# EAGLE design CR78-HB (EAGLE 7.1.0)
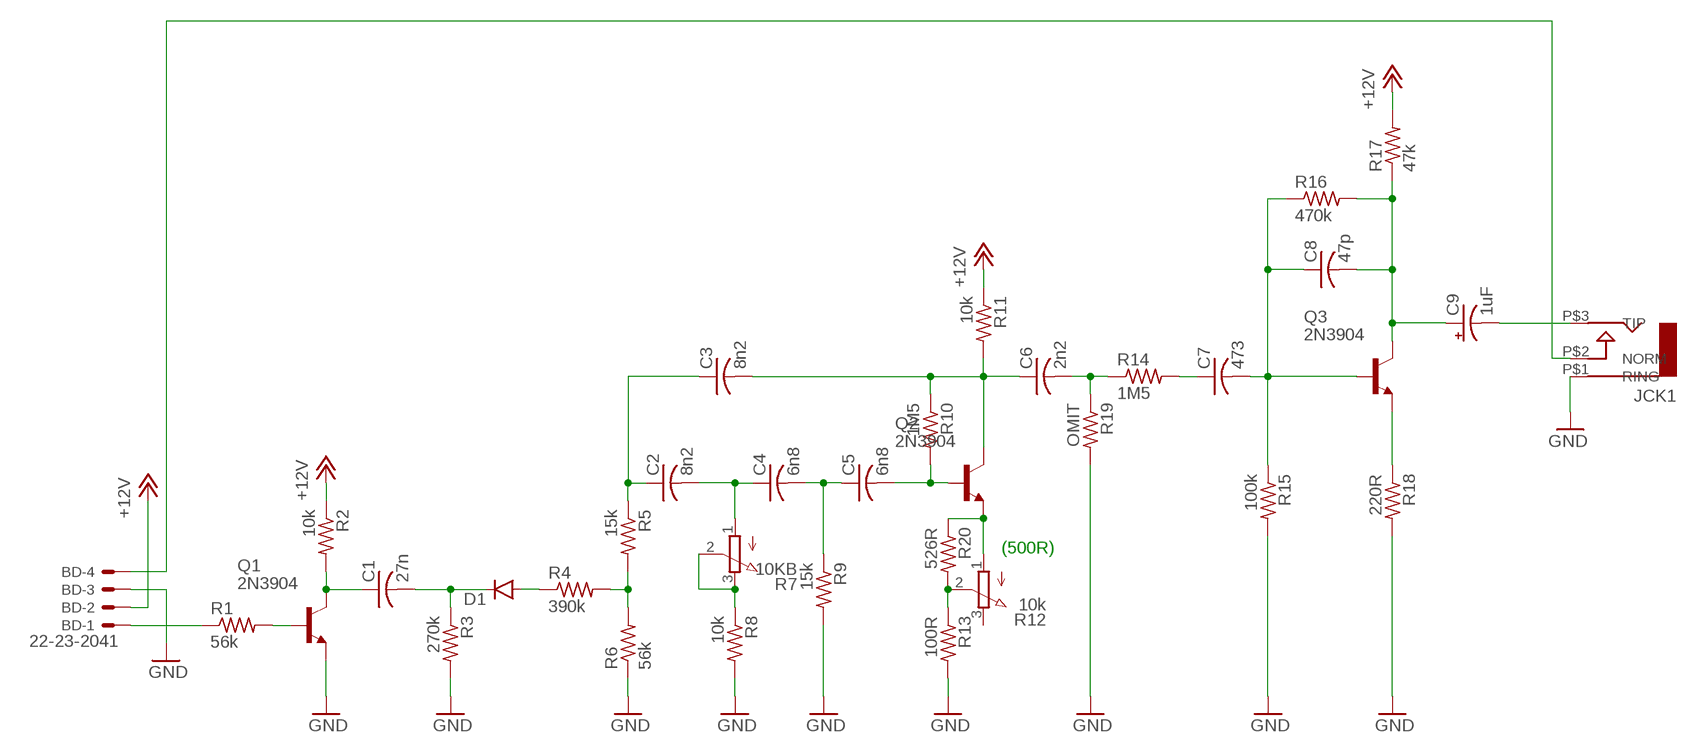
[diagram p0: schematic, sheet 1]

## Parts
BD  22-23-2041  [22-23-2041]
C1  27n  C-US050-025X075  [C050-025X075]
C2  8n2  C-US050-025X075  [C050-025X075]
C3  8n2  C-US050-025X075  [C050-025X075]
C4  6n8  C-US050-025X075  [C050-025X075]
C5  6n8  C-US050-025X075  [C050-025X075]
C6  2n2  C-US050-025X075  [C050-025X075]
C7  473  C-US050-025X075  [C050-025X075]
C8  47p  C-US050-025X075  [C050-025X075]
C9  1uF  CPOL-USB45181A  [B45181A]
D1  DIODE1N4148  [DIODE-1N4148]
JCK1  AUDIO-JACK  [ERTHENVAR-JACK-90DEG]
Q1  2N3904  [TO92]
Q2  2N3904  [TO92]
Q3  2N3904  [TO92]
R1  56k  R-US_0207/7  [0207/7]
R2  10k  R-US_0207/7  [0207/7]
R3  270k  R-US_0207/7  [0207/7]
R4  390k  R-US_0207/7  [0207/7]
R5  15k  R-US_0207/7  [0207/7]
R6  56k  R-US_0207/7  [0207/7]
R7  10KB  3RP/1610N  [3RP/1610N]
R8  10k  R-US_0207/7  [0207/7]
R9  15k  R-US_0207/5V  [0207/5V]
R10  1M5  R-US_0207/7  [0207/7]
R11  10k  R-US_0207/7  [0207/7]
R12  10k  3RP/1610N  [3RP/1610N]
R13  100R  R-US_0207/7  [0207/7]
R14  1M5  R-US_0207/7  [0207/7]
R15  100k  R-US_0207/7  [0207/7]
R16  470k  R-US_0207/7  [0207/7]
R17  47k  R-US_0207/7  [0207/7]
R18  220R  R-US_0207/7  [0207/7]
R19  OMIT  R-US_0207/5V  [0207/5V]
R20  526R  R-US_0207/5V  [0207/5V]

## Nets
+12V: BD.2 R2.1 R11.1 R17.2
GND: BD.3 JCK1.P$1(RING) Q1.3(E) R3.2 R6.1 R8.2 R9.2 R13.2 R15.2 R18.2 R19.2
N$1: C1.2 D1.C R3.1
N$2: D1.A R4.1
N$3: R4.2 R5.2 R6.2
N$4: C2.1 C3.1 R5.1
N$5: R7.2(S) R7.3(E) R8.1
N$6: C2.2 C4.1 R7.1(A)
N$7: C5.2 Q2.2(B) R10.2
N$8: R12.2(S) R13.1 R20.2
N$9: C3.2 C6.1 Q2.1(C) R10.1 R11.2
N$10: C4.2 C5.1 R9.1
N$11: BD.1 R1.1
N$12: BD.4 JCK1.P$2(NORM)
N$13: Q2.3(E) R12.1(A) R20.1
N$14: C6.2 R14.1 R19.1
N$15: Q3.3(E) R18.1
N$16: C8.2 C9.+ Q3.1(C) R16.2 R17.1
N$17: C7.1 R14.2
N$18: C7.2 C8.1 Q3.2(B) R15.1 R16.1
N$19: C9.- JCK1.P$3(TIP)
N$46: C1.1 Q1.1(C) R2.2
N$47: Q1.2(B) R1.2
Unconnected: R12.3(E)

## Notes on the sheet
- (500R)

## Library data of the parts
BD = con-molex:22-23-2041: .100" (2.54mm) Center Header - 4 Pin; MF: MOLEX; MPN: 22-23-2041; OC_FARNELL: 1462920; OC_NEWARK: 38C0355
C1-C8 = rcl:C-US: CAPACITOR, American symbol
C9 = rcl:CPOL-US: POLARIZED CAPACITOR, American symbol
D1 = SparkFun-DiscreteSemi:DIODE: Diode These are standard reverse protection diodes and small signal diodes. SMA package can handle up to about 1A. SOD-323 can handle about 200mA. What the SOD-323 package when ordering, there are some mfgs out there that are 5-pin packages.
JCK1 = erthenvar:AUDIO-JACK: Switching Mono 3.5mm Audio Jack from Erthenvar.
Q1-Q3 = 808_lt:2N3904: NPN Transistor
R1-R6 R8-R11 R13-R20 = rcl:R-US_: RESISTOR, American symbol
R7 R12 = pot:3RP/1610N: 16mm Potentiometer one level Source: http://www.alphapotentiometers.net/html/16mm_pot_2.html

## Net classes
0 default: width 0.635 mm, drill 0.254 mm, clearance 0.254 mm
1 GND: width 1.016 mm, drill 1.016 mm, clearance 0.508 mm

## Board
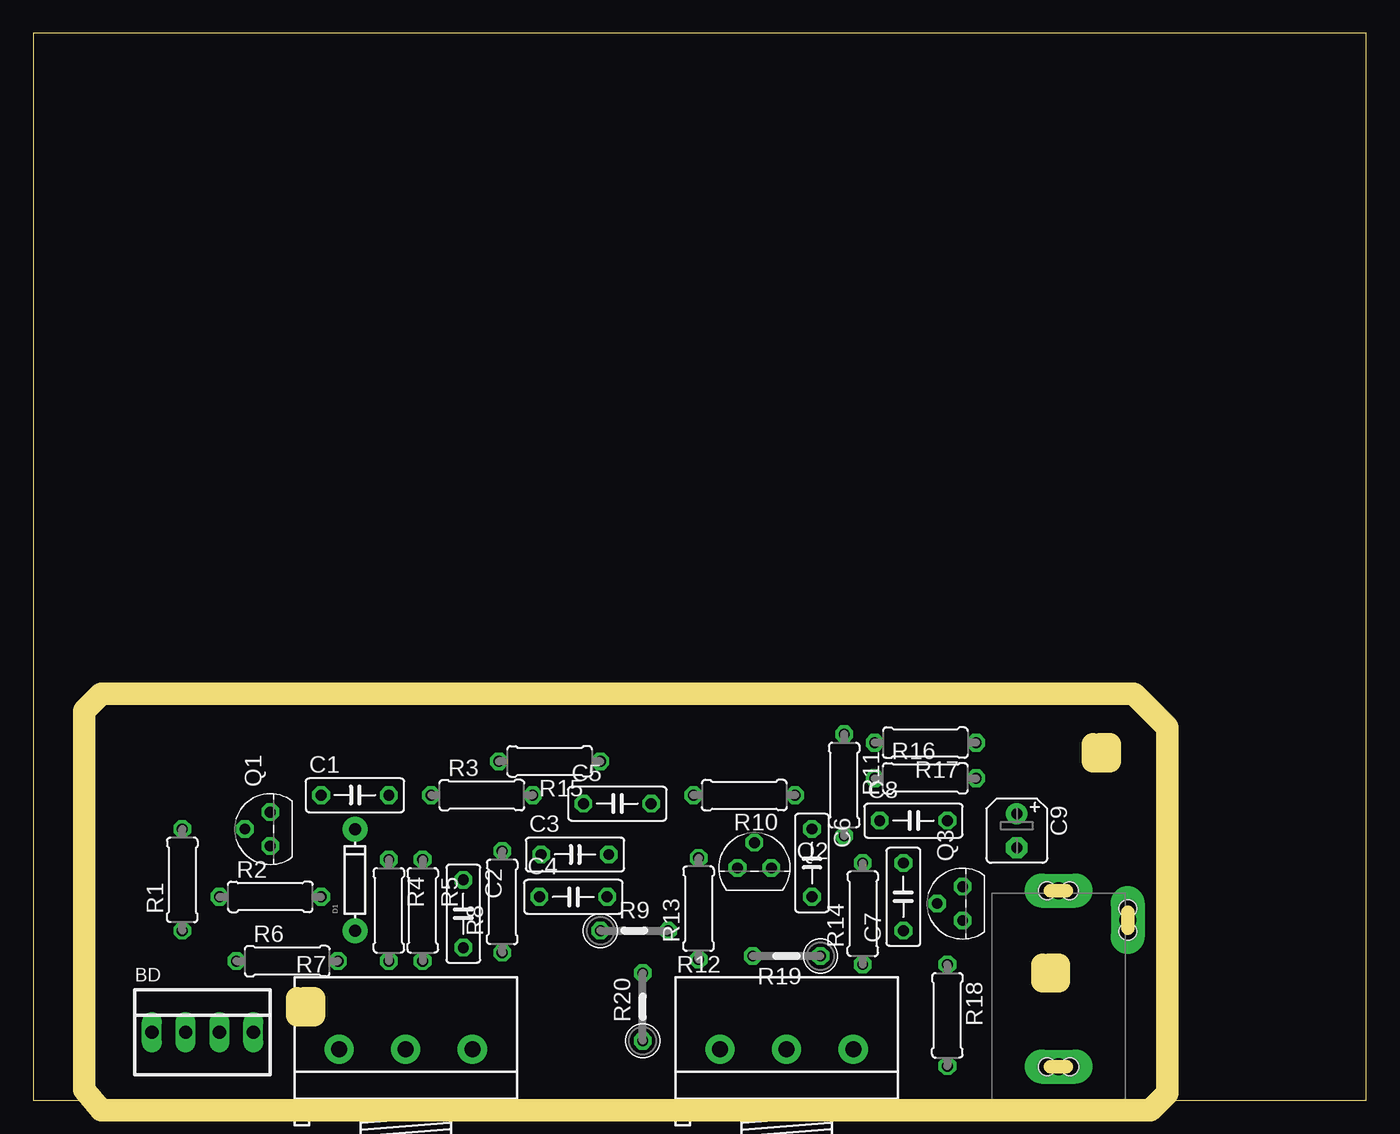
[diagram p1: board, top side]
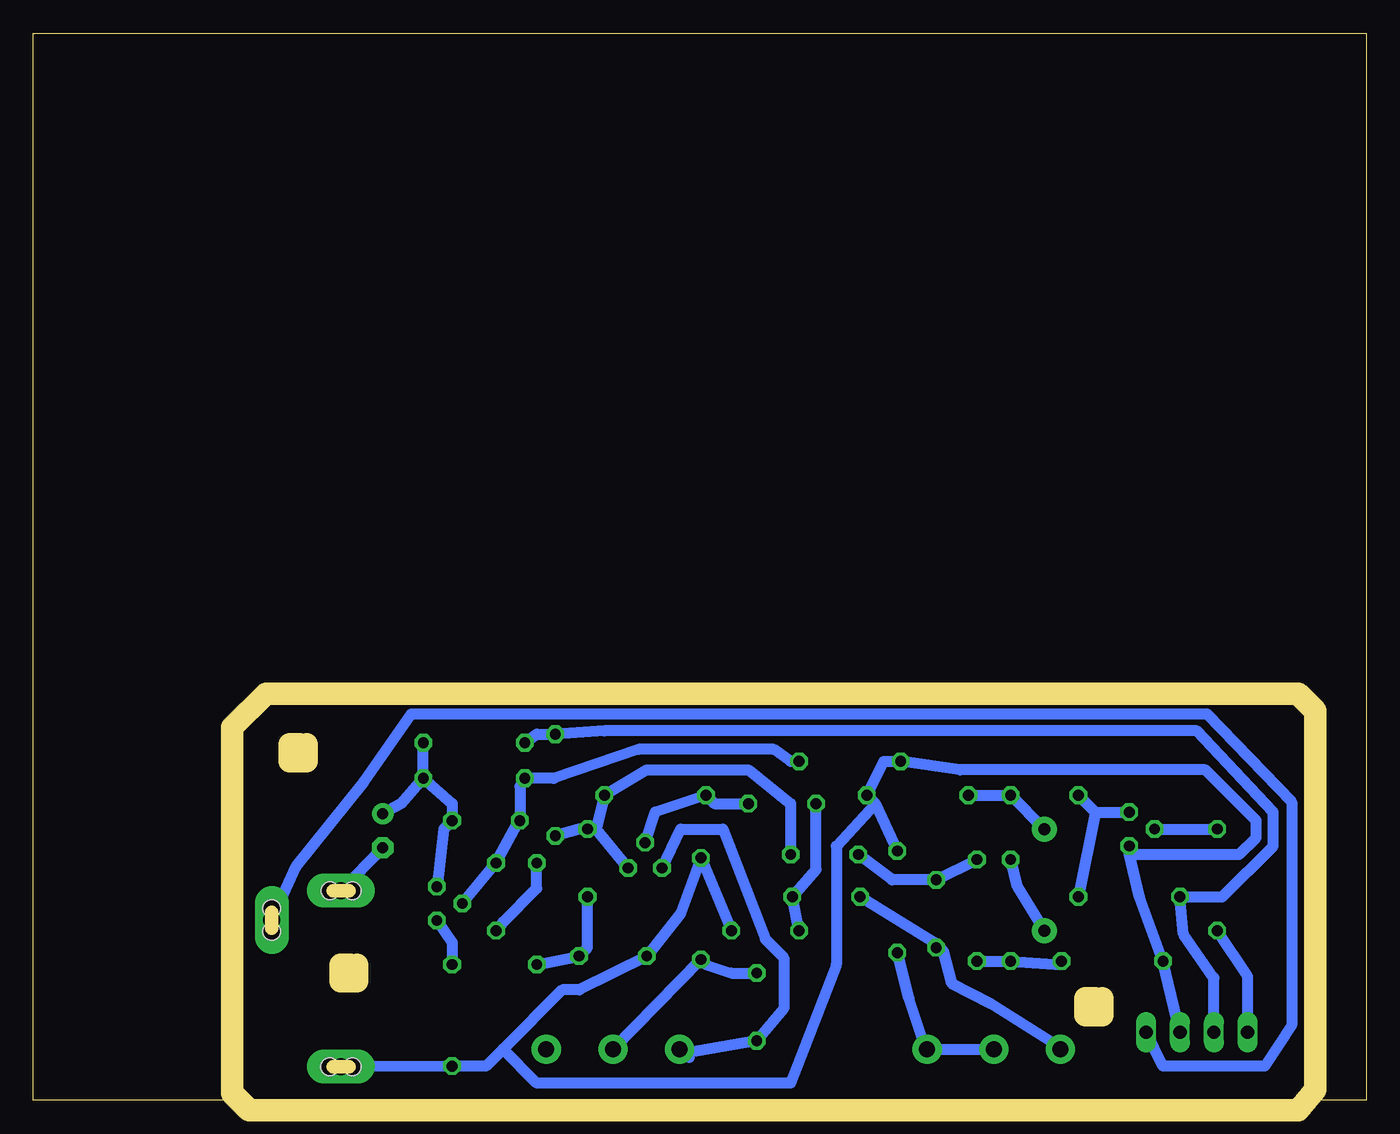
[diagram p2: board, bottom side, seen from below]

Size 100 x 80 mm. Coordinates in mm from the lower left corner, seen from the top.
Outline: 0,0 100,0 100,80 0,80 0,0
Copper layers (1*16): Top 0.035mm / dielectric 1.5mm / Bottom 0.035mm
Design rules "default *": minimum track width 32mil, minimum drill 31mil, track to track 18mil, track to pad 18mil, pad to pad 18mil, via to via 18mil, smd to smd 8mil, copper to edge 0mil, drill to drill 18mil, minimum pad ring 10mil, minimum via ring 8mil, stop-mask expansion 4mil, vias tented up to drill 0mil, thermal gap 10mil
Milling: 20 lines

### Footprints (pad centres in the part's own frame; a part is rotated, then mirrored left to right if it is on the bottom)
22-23-2041 = drill 1 long: 1 -3.81,0; 2 -1.27,0; 3 1.27,0; 4 3.81,0
C050-025X075 = drill 0.813 octagon: 1 -2.54,0; 2 2.54,0
B45181A = drill 0.813 pad 1.6: + -1.27,0 | drill 0.813 pad 1.6 octagon: - 1.27,0
DIODE-1N4148 = drill 0.9 pad 1.88: A -3.81,0; C 3.81,0
ERTHENVAR-JACK-90DEG = drill 1.3 pad 2.54 long: P$1 5,-2.5; P$2 -0.2,-13.5; P$3 5,-15.7 | hole 1.3: 5.842,-2.489; 4.14,-2.489; -0.203,-12.649; -0.203,-14.351; 5.842,-15.697; 4.166,-15.697
TO92 = drill 0.813 octagon: 1 1.27,0; 2 0,1.905; 3 -1.27,0
0207/7 = drill 0.813 octagon: 1 -3.81,0; 2 3.81,0
3RP/1610N = drill 1.2 pad 2.184: 1 -5,0; 2 0,0; 3 5,0
0207/5V = drill 0.813 octagon: 1 -2.54,0; 2 2.54,0

### Placement (x,y rotation side)
BD  12.7,5.08 0 top
C1  24.13,22.86 0 top
C2  32.26,13.97 270 top
C3  40.64,18.41 0 top
C4  40.51,15.24 0 top
C5  43.81,22.23 0 top
C6  58.42,17.78 270 top
C7  65.28,15.24 90 top
C8  66.04,20.95 0 top
C9  73.79,20.19 270 top
D1  24.13,16.51 90 top
JCK1  81.92,0 180 top
Q1  17.78,20.32 90 top
Q2  54.1,17.4 0 top
Q3  69.72,14.73 90 top
R1  11.18,16.51 90 top
R2  17.78,15.24 0 top
R3  33.66,22.86 0 top
R4  26.67,14.22 270 top
R5  29.21,14.22 270 top
R6  19.05,10.41 0 top
R7  27.94,3.81 0 top
R8  35.18,14.86 90 top
R9  45.09,12.7 0 top
R10  53.34,22.86 180 top
R11  60.83,23.62 270 top
R12  56.52,3.81 0 top
R13  49.91,14.35 90 top
R14  62.23,13.97 90 top
R15  38.73,25.4 180 top
R16  66.93,24.13 0 top
R17  66.93,26.8 180 top
R18  68.58,6.35 270 top
R19  56.52,10.79 180 top
R20  45.72,6.99 90 top

### Tracks (layer width: path | path; a pad name or v marks a point on that pad's centre or on a via)
+12V
  Bottom 0.813: R17.2 62.23,27.43 R11.1 57.15,27.69 12.7,27.69 6.99,21.59 6.99,19.05 10.79,15.24 R2.1 13.72,12.45 11.43,9.14 BD.2
GND
  Bottom 0.813: R9.2 R13.2 51.44,13.97 R19.2 59.05,8.26 60.33,8.26 64.77,3.81 | 64.77,3.81 66.04,2.54 R18.2 JCK1.P$1 | 36.83,22.23 R3.2 36.2,25.4 R15.2 30.48,24.77 12.06,24.77 8.26,20.95 8.26,19.68 9.53,18.41 17.78,18.41 | BD.3 R6.1 17.02,15.24 17.78,18.41 | 17.78,18.41 Q1.3 | 64.77,3.81 62.23,1.27 43.18,1.27 39.75,10.16 39.75,19.05 36.83,22.23 | 36.83,22.23 R8.2
N$1
  Bottom 0.813: R3.1 C1.2 D1.C
N$2
  Bottom 0.813: R4.1 26.16,16 D1.A
N$3
  Bottom 0.813: R5.2 R4.2 22.86,10.16 R6.2
N$4
  Bottom 0.813: R5.1 C2.1 35.56,16.51 C3.1
N$5
  Bottom 0.813: R8.1 34.29,7.62 33.02,3.81 R7.3 R7.2
N$6
  Bottom 0.813: 31.75,11.18 32.38,11.81 C4.1 | 31.75,11.18 C2.2 | R7.1 22.73,3.81 28.19,7.24 31.11,8.76 31.75,11.18
N$7
  Bottom 0.813: Q2.2 53.34,21.59 R10.2 48.9,22.23 C5.2
N$8
  Bottom 0.813: R20.2 47.62,9.53 49.53,10.16 R13.1 R12.2 57.15,3.81
N$9
  Bottom 0.813: 57.78,20.32 Q2.1 | R11.2 59.05,20.32 C6.1 57.78,20.32 | C3.2 43.18,22.23 46.35,24.77 53.98,24.77 R10.1 57.78,20.32
N$10
  Bottom 0.813: R9.1 C4.2 41.27,17.27 C5.1
N$11
  Bottom 0.813: R1.1 8.89,9.27 BD.1
N$12
  Bottom 0.813: JCK1.P$2 80.26,17.53 75.18,23.88 71.63,28.96 11.94,28.96 5.59,22.35 5.59,5.59 7.62,2.54 15.24,2.54 BD.4
N$13
  Bottom 0.813: 51.12,3.49 51.44,3.81 R12.1 | 51.12,3.49 50.8,3.17 | Q2.3 51.44,20.32 48.26,20.32 45.09,12.06 43.69,10.67 43.69,6.86 R20.1 51.12,3.49
N$14
  Bottom 0.813: R14.1 R19.1 58.42,11.43 C6.2
N$15
  Bottom 0.813: R18.1 68.58,11.81 Q3.3
N$16
  Bottom 0.813: R16.2 68.58,22.23 C8.2 69.22,20.32 Q3.1 | R16.2 R17.1 | C9.+ 72.39,22.23 R16.2
N$17
  Bottom 0.813: R14.2 62.23,15.88 64.77,13.34 C7.1
N$18
  Bottom 0.813: 63.5,21.08 63.5,23.5 R16.1 60.96,24.13 54.61,26.29 44.45,26.29 43.18,25.4 R15.1 | Q3.2 C7.2 63.5,21.08 | 63.5,21.08 C8.1
N$19
  Bottom 0.813: C9.- JCK1.P$3
N$46
  Bottom 0.813: 20.32,21.59 Q1.1 | C1.1 20.32,21.59 | 20.32,21.59 R2.2
N$47
  Bottom 0.813: Q1.2 R1.2